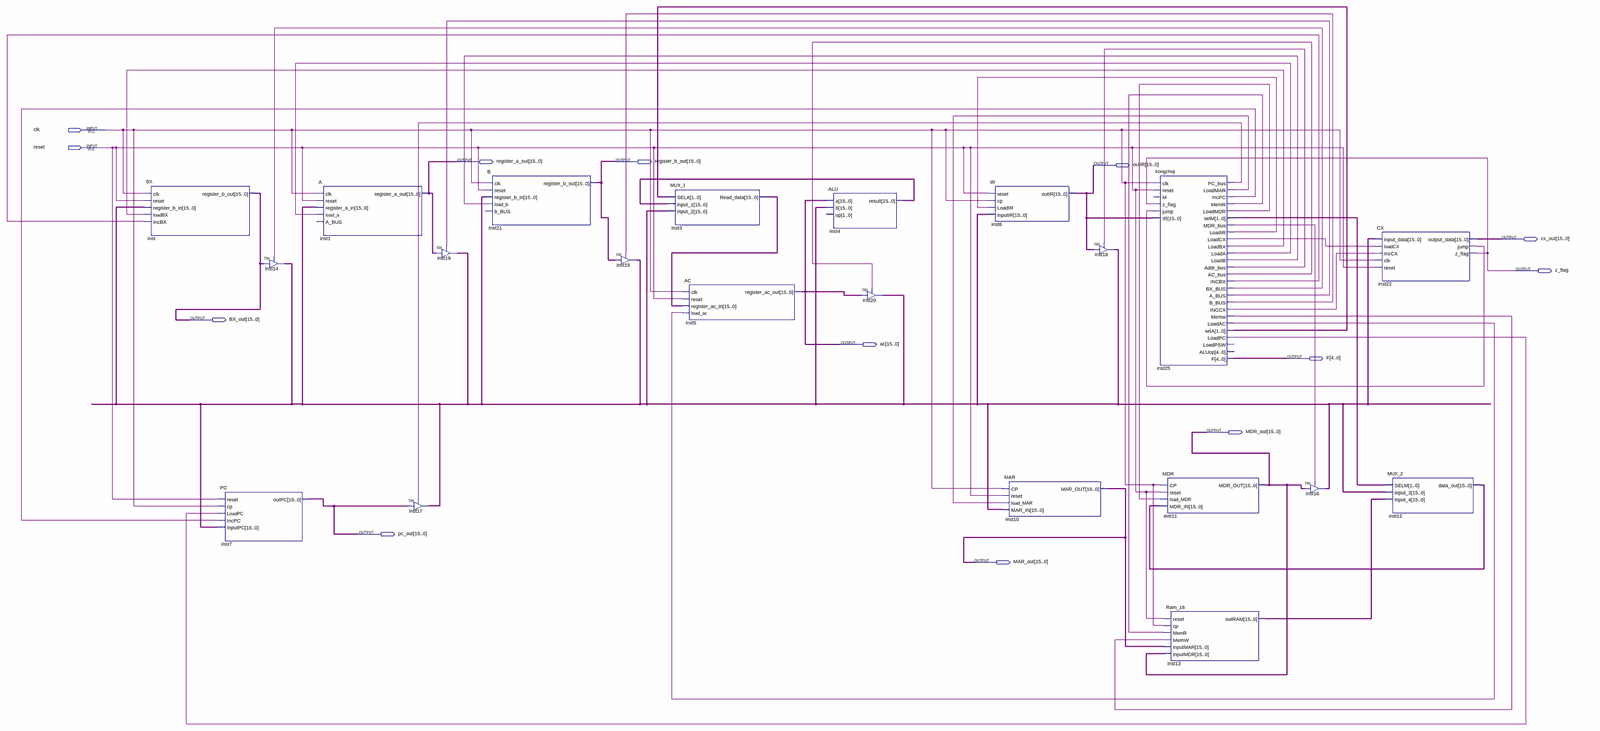
[diagram p0: schematic sheet, whole]
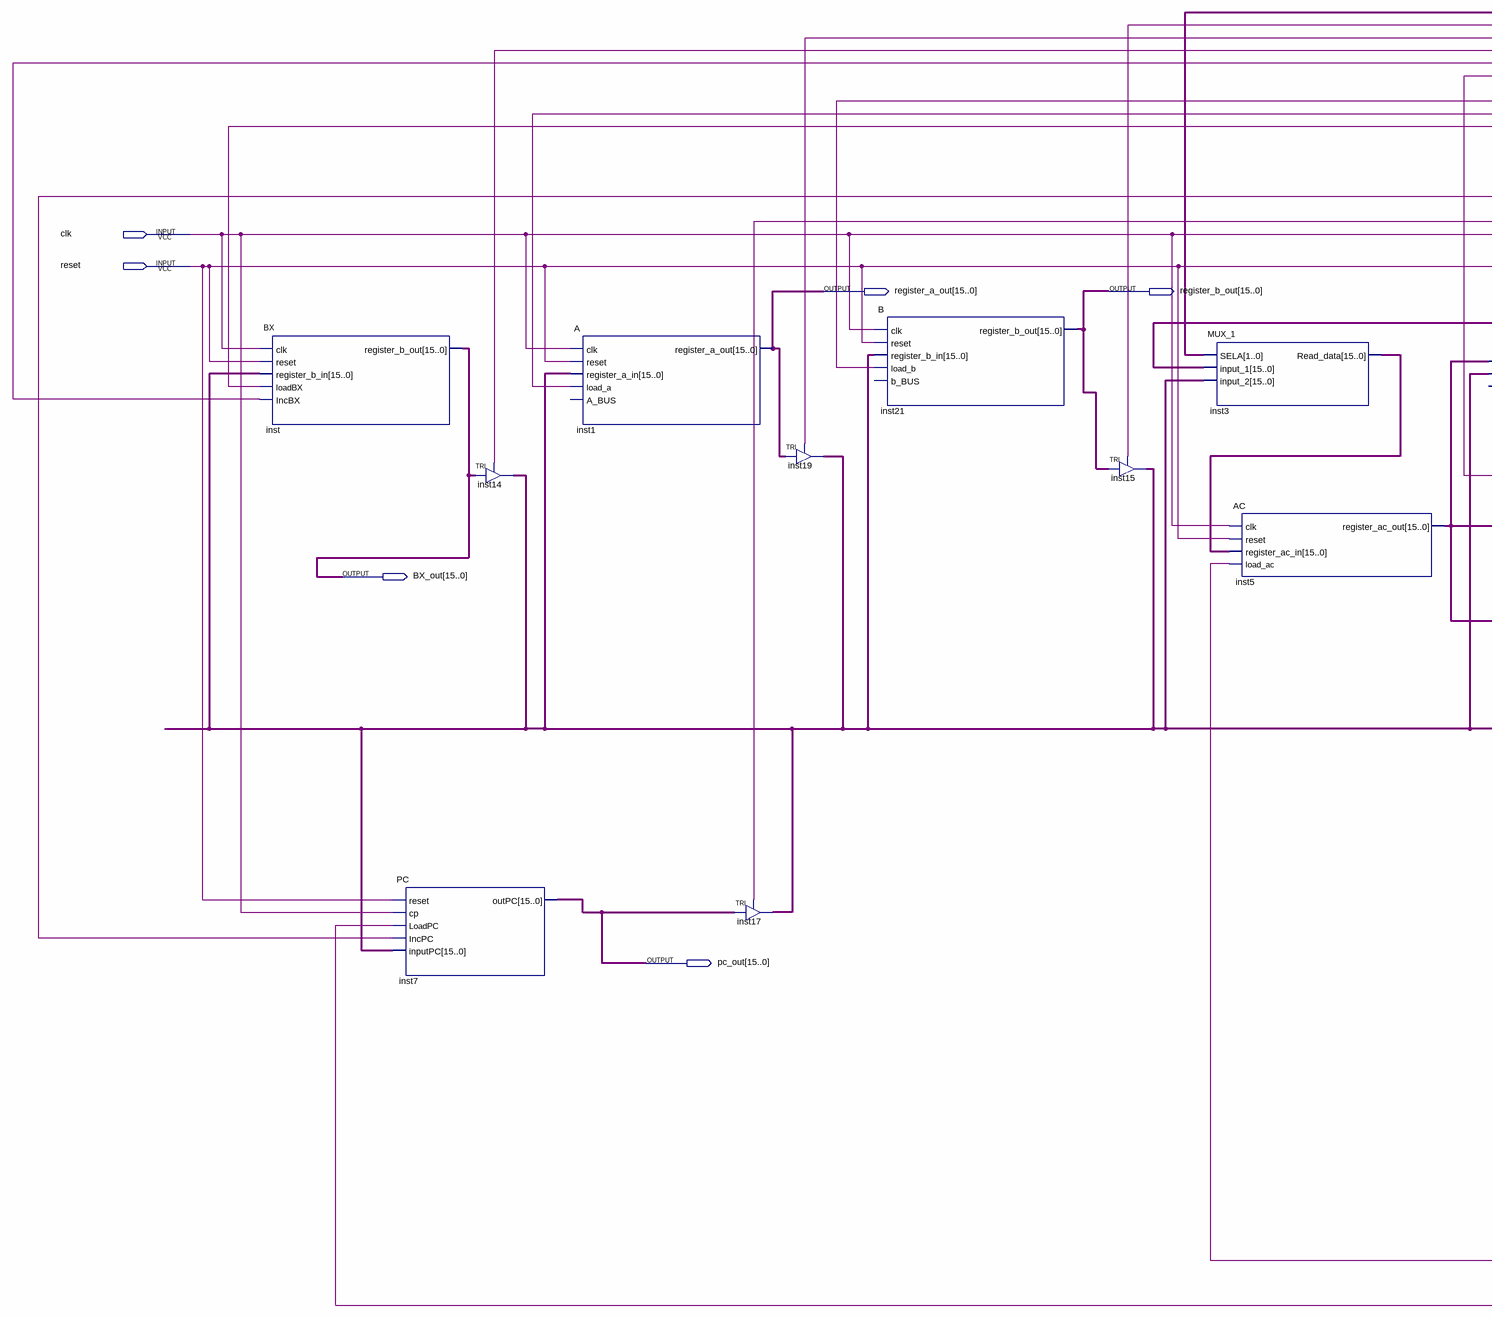
[diagram p1: schematic sheet, left part]
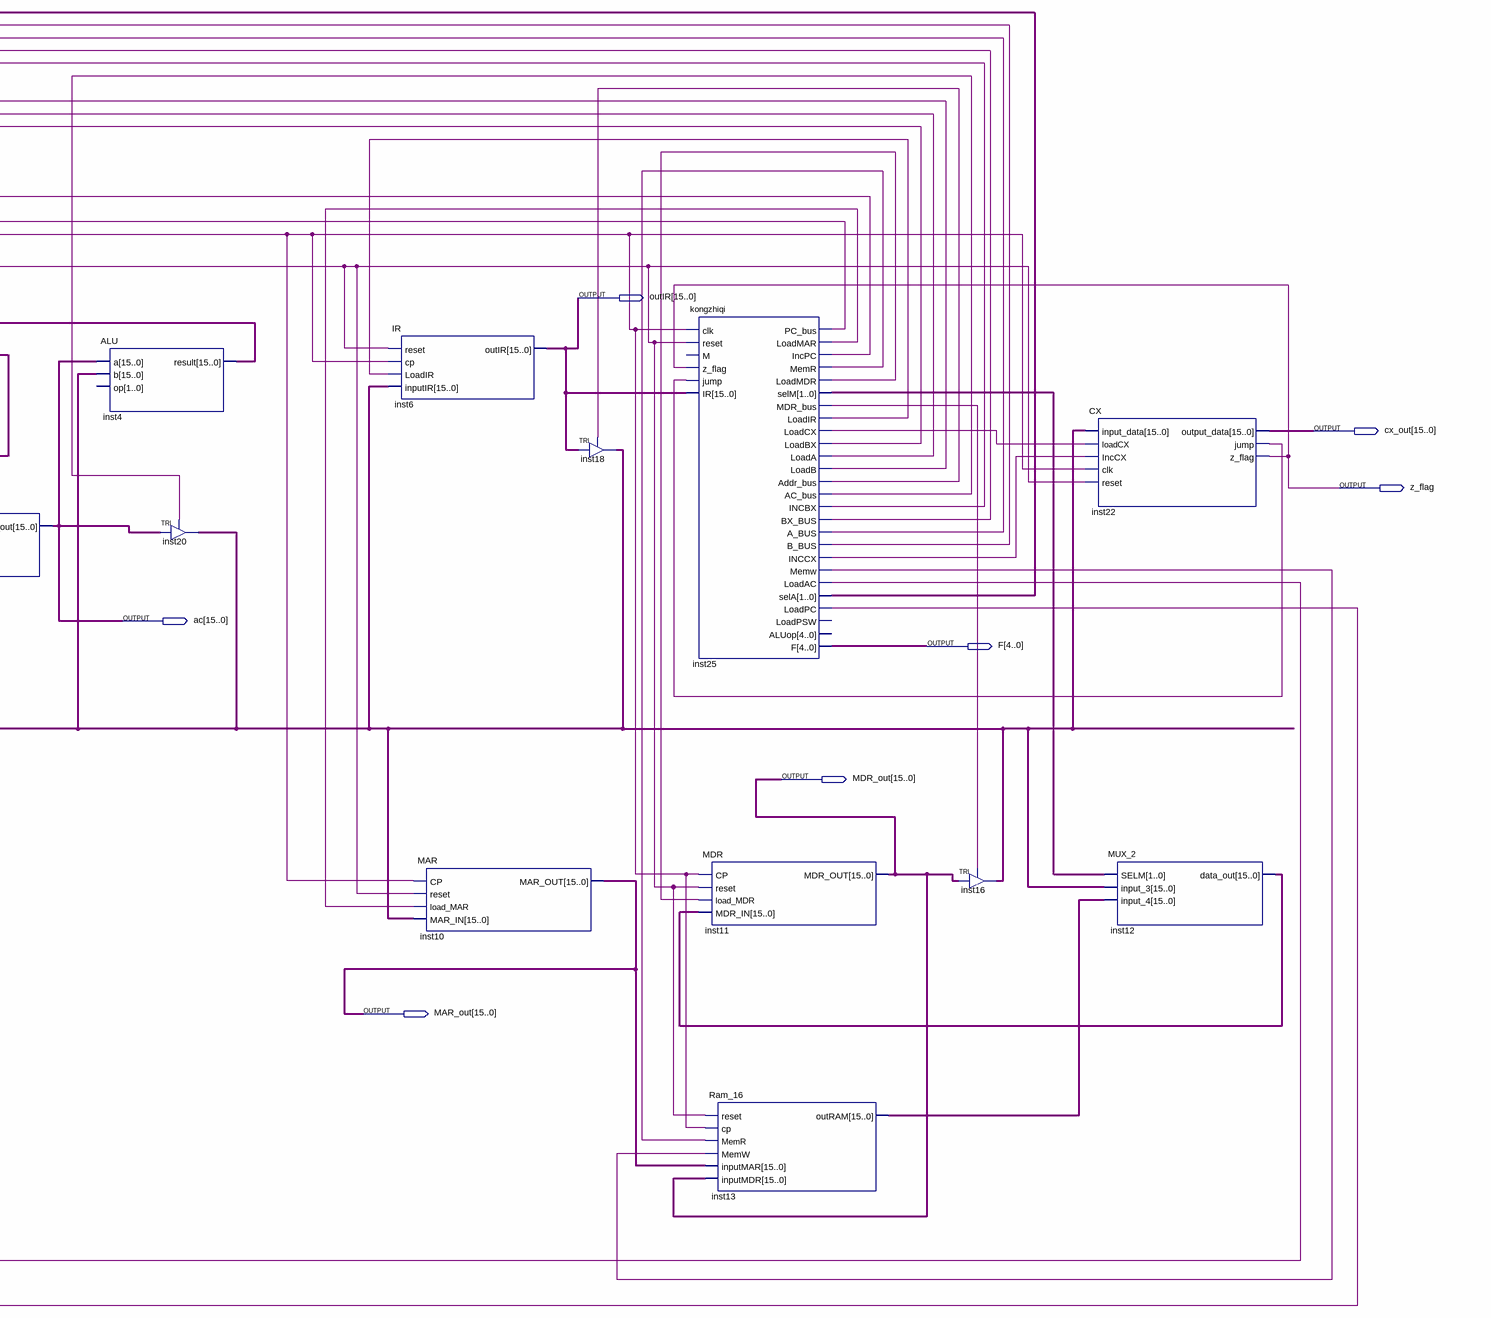
[diagram p2: schematic sheet, right part]
// Quartus schematic Block2.bdf as structural Verilog: 21 symbols, 13 pins
module Block2 (
  input  clk,
  input  reset,
  output [15:0] register_a_out,
  output [15:0] register_b_out,
  output [15:0] outIR,
  output [15:0] cx_out,
  output z_flag,
  output [15:0] BX_out,
  output [15:0] ac,
  output [4:0] F,
  output [15:0] MDR_out,
  output [15:0] pc_out,
  output [15:0] MAR_out
);

  wire inst22_jump, inst25_a_bus, inst25_ac_bus, inst25_addr_bus, inst25_b_bus, inst25_bx_bus, inst25_incbx,
       inst25_inccx, inst25_incpc, inst25_loada, inst25_loadac, inst25_loadb, inst25_loadbx, inst25_loadcx,
       inst25_loadir, inst25_loadmar, inst25_loadmdr, inst25_loadpc, inst25_mdr_bus, inst25_memr,
       inst25_memw, inst25_pc_bus;
  wire [1:0] inst25_sela, inst25_selm;
  wire [15:0] inst3_read_data, inst4_result, inst12_data_out, inst13_outram, inst14_out;

  BX inst (
    .clk(clk), .reset(reset), .register_b_in(inst14_out), .loadBX(inst25_loadbx), .IncBX(inst25_incbx),
    .register_b_out(BX_out));
  PC inst7 (
    .reset(reset), .cp(clk), .LoadPC(inst25_loadpc), .IncPC(inst25_incpc), .inputPC(inst14_out),
    .outPC(pc_out));
  TRI inst14[15:0] (.IN(BX_out), .OE(inst25_bx_bus), .OUT(inst14_out));
  A inst1 (
    .clk(clk), .reset(reset), .register_a_in(inst14_out), .load_a(inst25_loada),
    .register_a_out(register_a_out));  // open: A_BUS
  TRI inst17[15:0] (.IN(pc_out), .OE(inst25_pc_bus), .OUT(inst14_out));
  TRI inst19[15:0] (.IN(register_a_out), .OE(inst25_a_bus), .OUT(inst14_out));
  B inst21 (
    .clk(clk), .reset(reset), .register_b_in(inst14_out), .load_b(inst25_loadb),
    .register_b_out(register_b_out));  // open: b_BUS
  TRI inst15[15:0] (.IN(register_b_out), .OE(inst25_b_bus), .OUT(inst14_out));
  MUX_1 inst3 (.SELA(inst25_sela), .input_1(inst4_result), .input_2(inst14_out), .Read_data(inst3_read_data));
  AC inst5 (.clk(clk), .reset(reset), .register_ac_in(inst3_read_data), .load_ac(inst25_loadac), .register_ac_out(ac));
  ALU inst4 (.a(ac), .b(inst14_out), .result(inst4_result));  // open: op
  TRI inst20[15:0] (.IN(ac), .OE(inst25_ac_bus), .OUT(inst14_out));
  IR inst6 (.reset(reset), .cp(clk), .LoadIR(inst25_loadir), .inputIR(inst14_out), .outIR(outIR));
  MAR inst10 (.CP(clk), .reset(reset), .load_MAR(inst25_loadmar), .MAR_IN(inst14_out), .MAR_OUT(MAR_out));
  TRI inst18[15:0] (.IN(outIR), .OE(inst25_addr_bus), .OUT(inst14_out));
  kongzhiqi inst25 (
    .clk(clk), .reset(reset), .z_flag(z_flag), .jump(inst22_jump), .IR(outIR), .PC_bus(inst25_pc_bus),
    .LoadMAR(inst25_loadmar), .IncPC(inst25_incpc), .MemR(inst25_memr), .LoadMDR(inst25_loadmdr),
    .selM(inst25_selm), .MDR_bus(inst25_mdr_bus), .LoadIR(inst25_loadir), .LoadCX(inst25_loadcx),
    .LoadBX(inst25_loadbx), .LoadA(inst25_loada), .LoadB(inst25_loadb), .Addr_bus(inst25_addr_bus),
    .AC_bus(inst25_ac_bus), .INCBX(inst25_incbx), .BX_BUS(inst25_bx_bus), .A_BUS(inst25_a_bus),
    .B_BUS(inst25_b_bus), .INCCX(inst25_inccx), .Memw(inst25_memw), .LoadAC(inst25_loadac),
    .selA(inst25_sela), .LoadPC(inst25_loadpc), .F(F));  // open: M, LoadPSW, ALUop
  MDR inst11 (.CP(clk), .reset(reset), .load_MDR(inst25_loadmdr), .MDR_IN(inst12_data_out), .MDR_OUT(MDR_out));
  Ram_16 inst13 (
    .reset(reset), .cp(clk), .MemR(inst25_memr), .MemW(inst25_memw), .inputMAR(MAR_out), .inputMDR(MDR_out),
    .outRAM(inst13_outram));
  TRI inst16[15:0] (.IN(MDR_out), .OE(inst25_mdr_bus), .OUT(inst14_out));
  CX inst22 (
    .input_data(inst14_out), .loadCX(inst25_loadcx), .IncCX(inst25_inccx), .clk(clk), .reset(reset),
    .output_data(cx_out), .jump(inst22_jump), .z_flag(z_flag));
  MUX_2 inst12 (.SELM(inst25_selm), .input_3(inst14_out), .input_4(inst13_outram), .data_out(inst12_data_out));
endmodule
